# EAGLE schematic altair (EAGLE 9.4.1)

## Sheet 1 of 2
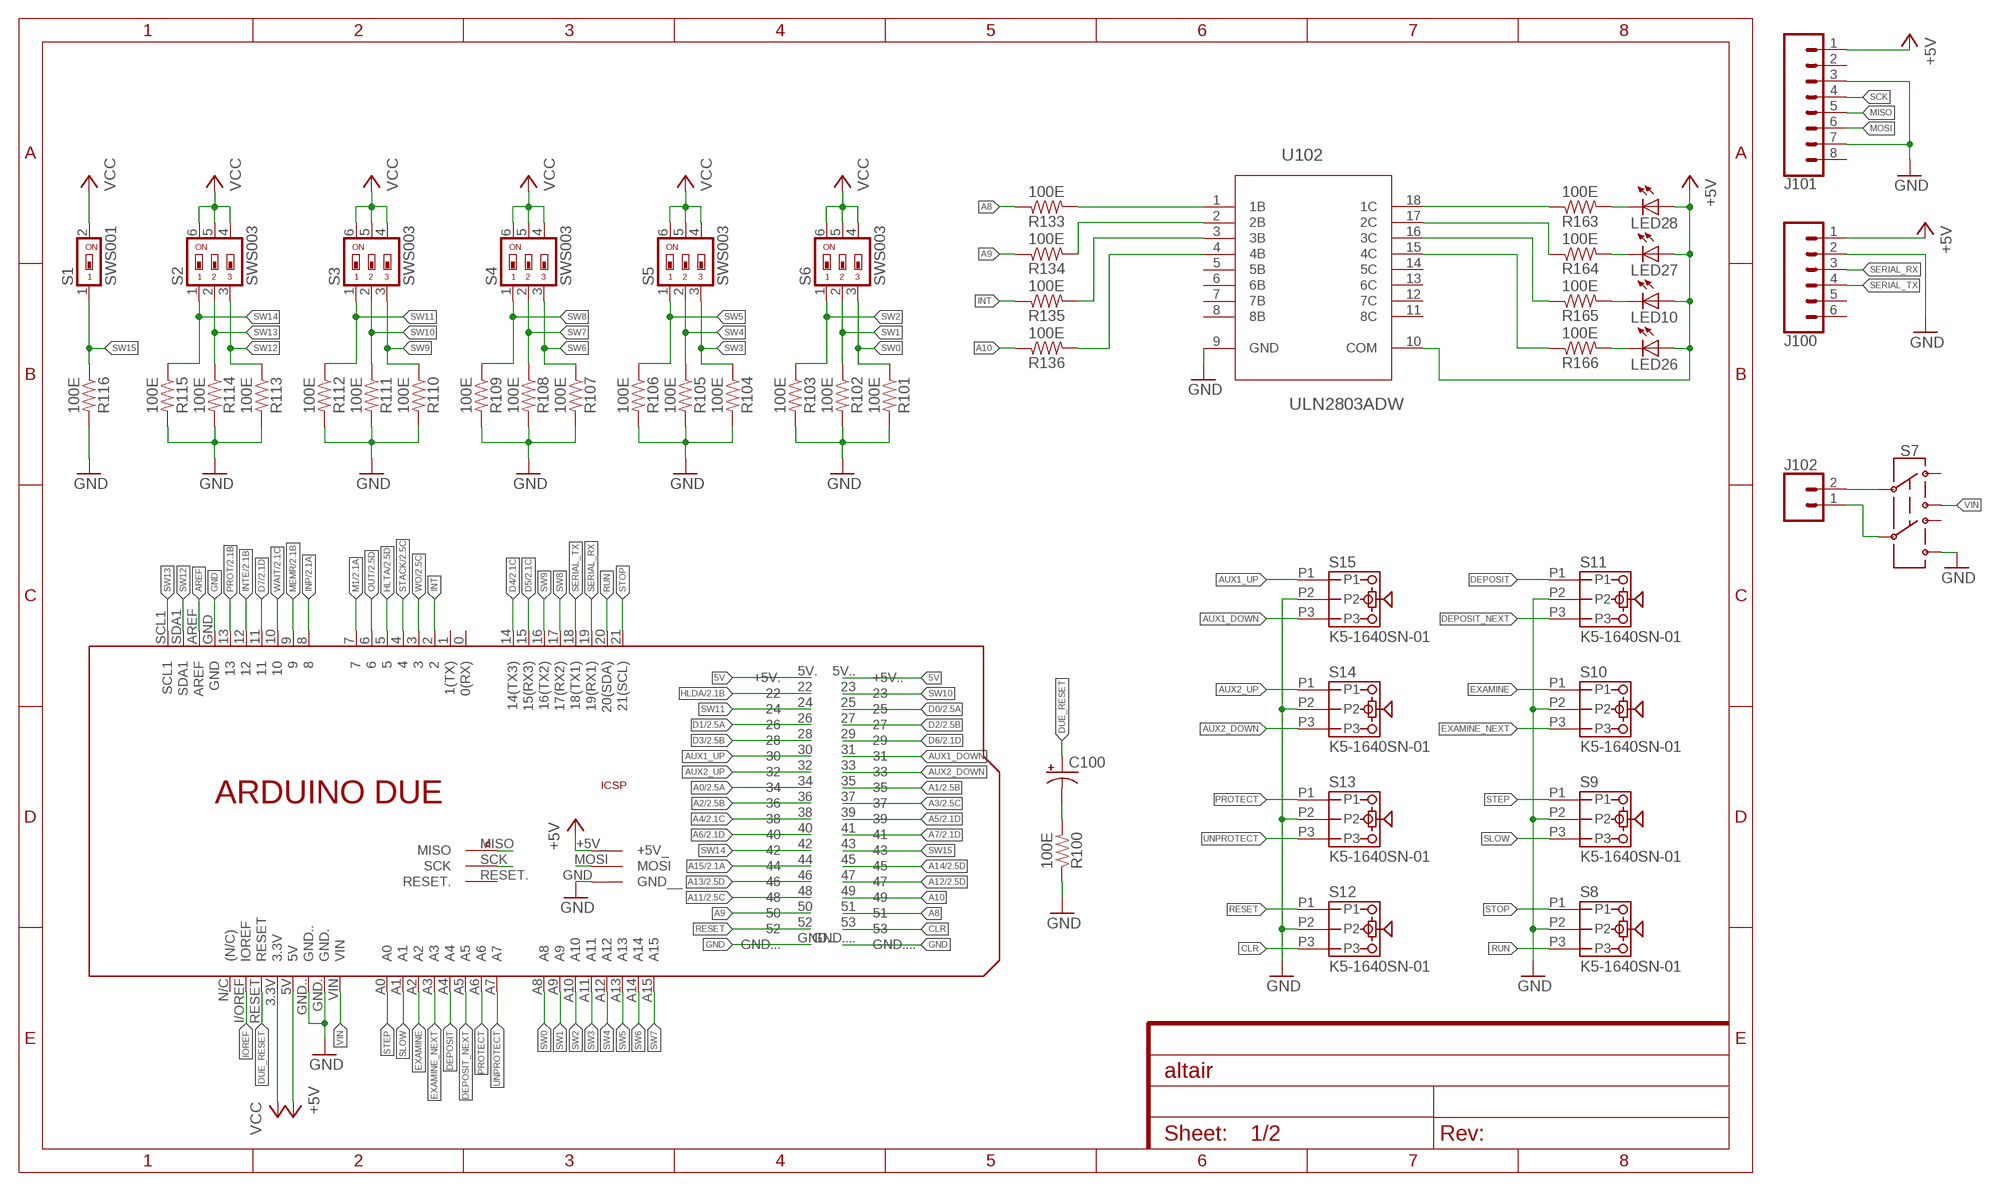
[diagram p0: schematic, sheet 1]

### Parts
C100  CPOL-USD  [PANASONIC_D]
J100  CONN_06LOCK  [1X06_LOCK]
J101  CONN_08LOCK  [1X08_LOCK]
J102  CONN_02POLAR_LOCK  [MOLEX-1X2_LOCK]
LED10  LEDCHIP-LED0805  [CHIP-LED0805]
LED26  LEDCHIP-LED0805  [CHIP-LED0805]
LED27  LEDCHIP-LED0805  [CHIP-LED0805]
LED28  LEDCHIP-LED0805  [CHIP-LED0805]
PCB1  ARDUINO_DUEARDUINO_DUE  [ARDUINO_MEGA2560]
R100  100E  RESISTOR0805  [0805]
R101  100E  RESISTOR0805  [0805]
R102  100E  RESISTOR0805  [0805]
R103  100E  RESISTOR0805  [0805]
R104  100E  RESISTOR0805  [0805]
R105  100E  RESISTOR0805  [0805]
R106  100E  RESISTOR0805  [0805]
R107  100E  RESISTOR0805  [0805]
R108  100E  RESISTOR0805  [0805]
R109  100E  RESISTOR0805  [0805]
R110  100E  RESISTOR0805  [0805]
R111  100E  RESISTOR0805  [0805]
R112  100E  RESISTOR0805  [0805]
R113  100E  RESISTOR0805  [0805]
R114  100E  RESISTOR0805  [0805]
R115  100E  RESISTOR0805  [0805]
R116  100E  RESISTOR0805  [0805]
R133  100E  RESISTOR0805  [0805]
R134  100E  RESISTOR0805  [0805]
R135  100E  RESISTOR0805  [0805]
R136  100E  RESISTOR0805  [0805]
R163  100E  RESISTOR0805  [0805]
R164  100E  RESISTOR0805  [0805]
R165  100E  RESISTOR0805  [0805]
R166  100E  RESISTOR0805  [0805]
S1  SWS001  [SMS-001]
S2  SWS003  [SMS-003]
S3  SWS003  [SMS-003]
S4  SWS003  [SMS-003]
S5  SWS003  [SMS-003]
S6  SWS003  [SMS-003]
S7  SWITCH-DPDT-SMD-AYZ0202  [SWITCH_DPDT_SMD_AYZ0202]
S8  K5-1640SN-01  [K5-1640SN-01]
S9  K5-1640SN-01  [K5-1640SN-01]
S10  K5-1640SN-01  [K5-1640SN-01]
S11  K5-1640SN-01  [K5-1640SN-01]
S12  K5-1640SN-01  [K5-1640SN-01]
S13  K5-1640SN-01  [K5-1640SN-01]
S14  K5-1640SN-01  [K5-1640SN-01]
S15  K5-1640SN-01  [K5-1640SN-01]
U102  ULN2803ADW  [SOIC127P1030X265-18N]

### Nets
5V: PCB1.5V.(+5V.) PCB1.5V..(+5V..)
+5V: J100.1 J101.1 LED10.A LED26.A LED27.A LED28.A PCB1.5V PCB1.+5V_ U102.10(COM) ; also sheet 2
A0: PCB1.34 ; also sheet 2
A1: PCB1.35 ; also sheet 2
A2: PCB1.36 ; also sheet 2
A3: PCB1.37 ; also sheet 2
A4: PCB1.38 ; also sheet 2
A5: PCB1.39 ; also sheet 2
A6: PCB1.40 ; also sheet 2
A7: PCB1.41 ; also sheet 2
A8: PCB1.51 R133.1
A9: PCB1.50 R134.1
A10: PCB1.49 R136.1
A11: PCB1.48 ; also sheet 2
A12: PCB1.47 ; also sheet 2
A13: PCB1.46 ; also sheet 2
A14: PCB1.45 ; also sheet 2
A15: PCB1.44 ; also sheet 2
AREF: PCB1.AREF
AUX1_DOWN: PCB1.31 S15.P3
AUX1_UP: PCB1.30 S15.P1
AUX2_DOWN: PCB1.33 S14.P3
AUX2_UP: PCB1.32 S14.P1
CLR: PCB1.53 S12.P3
D0: PCB1.25 ; also sheet 2
D1: PCB1.26 ; also sheet 2
D2: PCB1.27 ; also sheet 2
D3: PCB1.28 ; also sheet 2
D4: PCB1.14(14(TX3)) ; also sheet 2
D5: PCB1.15(15(RX3)) ; also sheet 2
D6: PCB1.29 ; also sheet 2
D7: PCB1.11 ; also sheet 2
DEPOSIT: PCB1.A4 S11.P1
DEPOSIT_NEXT: PCB1.A5 S11.P3
DUE_RESET: C100.+ PCB1.RESET
EXAMINE: PCB1.A2 S10.P1
EXAMINE_NEXT: PCB1.A3 S10.P3
GND: J100.2 J101.3 J101.7 PCB1.GND PCB1.GND. PCB1.GND.. PCB1.GND... PCB1.GND.... PCB1.GND__ R100.1 R101.2 R102.2 R103.2 R104.2 R105.2 R106.2 R107.2 R108.2 R109.2 R110.2 R111.2 R112.2 R113.2 R114.2 R115.2 R116.2 S7.6 S8.P2 S9.P2 S10.P2 S11.P2 S12.P2 S13.P2 S14.P2 S15.P2 U102.9(GND) ; also sheet 2
HLDA: PCB1.22 ; also sheet 2
HLTA: PCB1.5 ; also sheet 2
INP: PCB1.8 ; also sheet 2
INT: PCB1.2 R135.1
INTE: PCB1.12 ; also sheet 2
IOREF: PCB1.I/OREF(IOREF)
M1: PCB1.7 ; also sheet 2
MEMR: PCB1.9 ; also sheet 2
MISO: J101.5 PCB1.MISO
MOSI: J101.6 PCB1.MOSI
N$1: LED28.C R163.2
N$2: LED27.C R164.2
N$3: LED10.C R165.2
N$4: LED26.C R166.2
N$9: R163.1 U102.18(1C)
N$10: R164.1 U102.17(2C)
N$11: R165.1 U102.16(3C)
N$12: R166.1 U102.15(4C)
N$13: C100.- R100.2
N$19: R133.2 U102.1(1B)
N$20: R134.2 U102.2(2B)
N$21: R135.2 U102.3(3B)
N$22: R136.2 U102.4(4B)
N$97: J102.2 S7.2
N$98: J102.1 S7.5
OUT: PCB1.6 ; also sheet 2
PROT: PCB1.13 ; also sheet 2
PROTECT: PCB1.A6 S13.P1
RESET: PCB1.52 S12.P1
RUN: PCB1.20(20(SDA)) S8.P3
SCK: J101.4 PCB1.SCK
SERIAL_RX: J100.3 PCB1.19(19(RX1))
SERIAL_TX: J100.4 PCB1.18(18(TX1))
SLOW: PCB1.A1 S9.P3
STACK: PCB1.4 ; also sheet 2
STEP: PCB1.A0 S9.P1
STOP: PCB1.21(21(SCL)) S8.P1
SW0: PCB1.A8 R101.1 S6.3
SW1: PCB1.A9 R102.1 S6.2
SW2: PCB1.A10 R103.1 S6.1
SW3: PCB1.A11 R104.1 S5.3
SW4: PCB1.A12 R105.1 S5.2
SW5: PCB1.A13 R106.1 S5.1
SW6: PCB1.A14 R107.1 S4.3
SW7: PCB1.A15 R108.1 S4.2
SW8: PCB1.17(17(RX2)) R109.1 S4.1
SW9: PCB1.16(16(TX2)) R110.1 S3.3
SW10: PCB1.23 R111.1 S3.2
SW11: PCB1.24 R112.1 S3.1
SW12: PCB1.SDA1 R113.1 S2.3
SW13: PCB1.SCL1 R114.1 S2.2
SW14: PCB1.42 R115.1 S2.1
SW15: PCB1.43 R116.1 S1.1
UNPROTECT: PCB1.A7 S13.P3
VCC: PCB1.3.3V S1.2 S2.4 S2.5 S2.6 S3.4 S3.5 S3.6 S4.4 S4.5 S4.6 S5.4 S5.5 S5.6 S6.4 S6.5 S6.6
VIN: PCB1.VIN S7.3
WAIT: PCB1.10 ; also sheet 2
WO: PCB1.3 ; also sheet 2
Unconnected: J100.5 J100.6 J101.2 J101.8 PCB1.0(0(RX)) PCB1.1(1(TX)) PCB1.N/C((N/C)) PCB1.RESET. S7.1 S7.4 U102.5(5B) U102.6(6B) U102.7(7B) U102.8(8B) U102.11(8C) U102.12(7C) U102.13(6C) U102.14(5C)

## Sheet 2 of 2
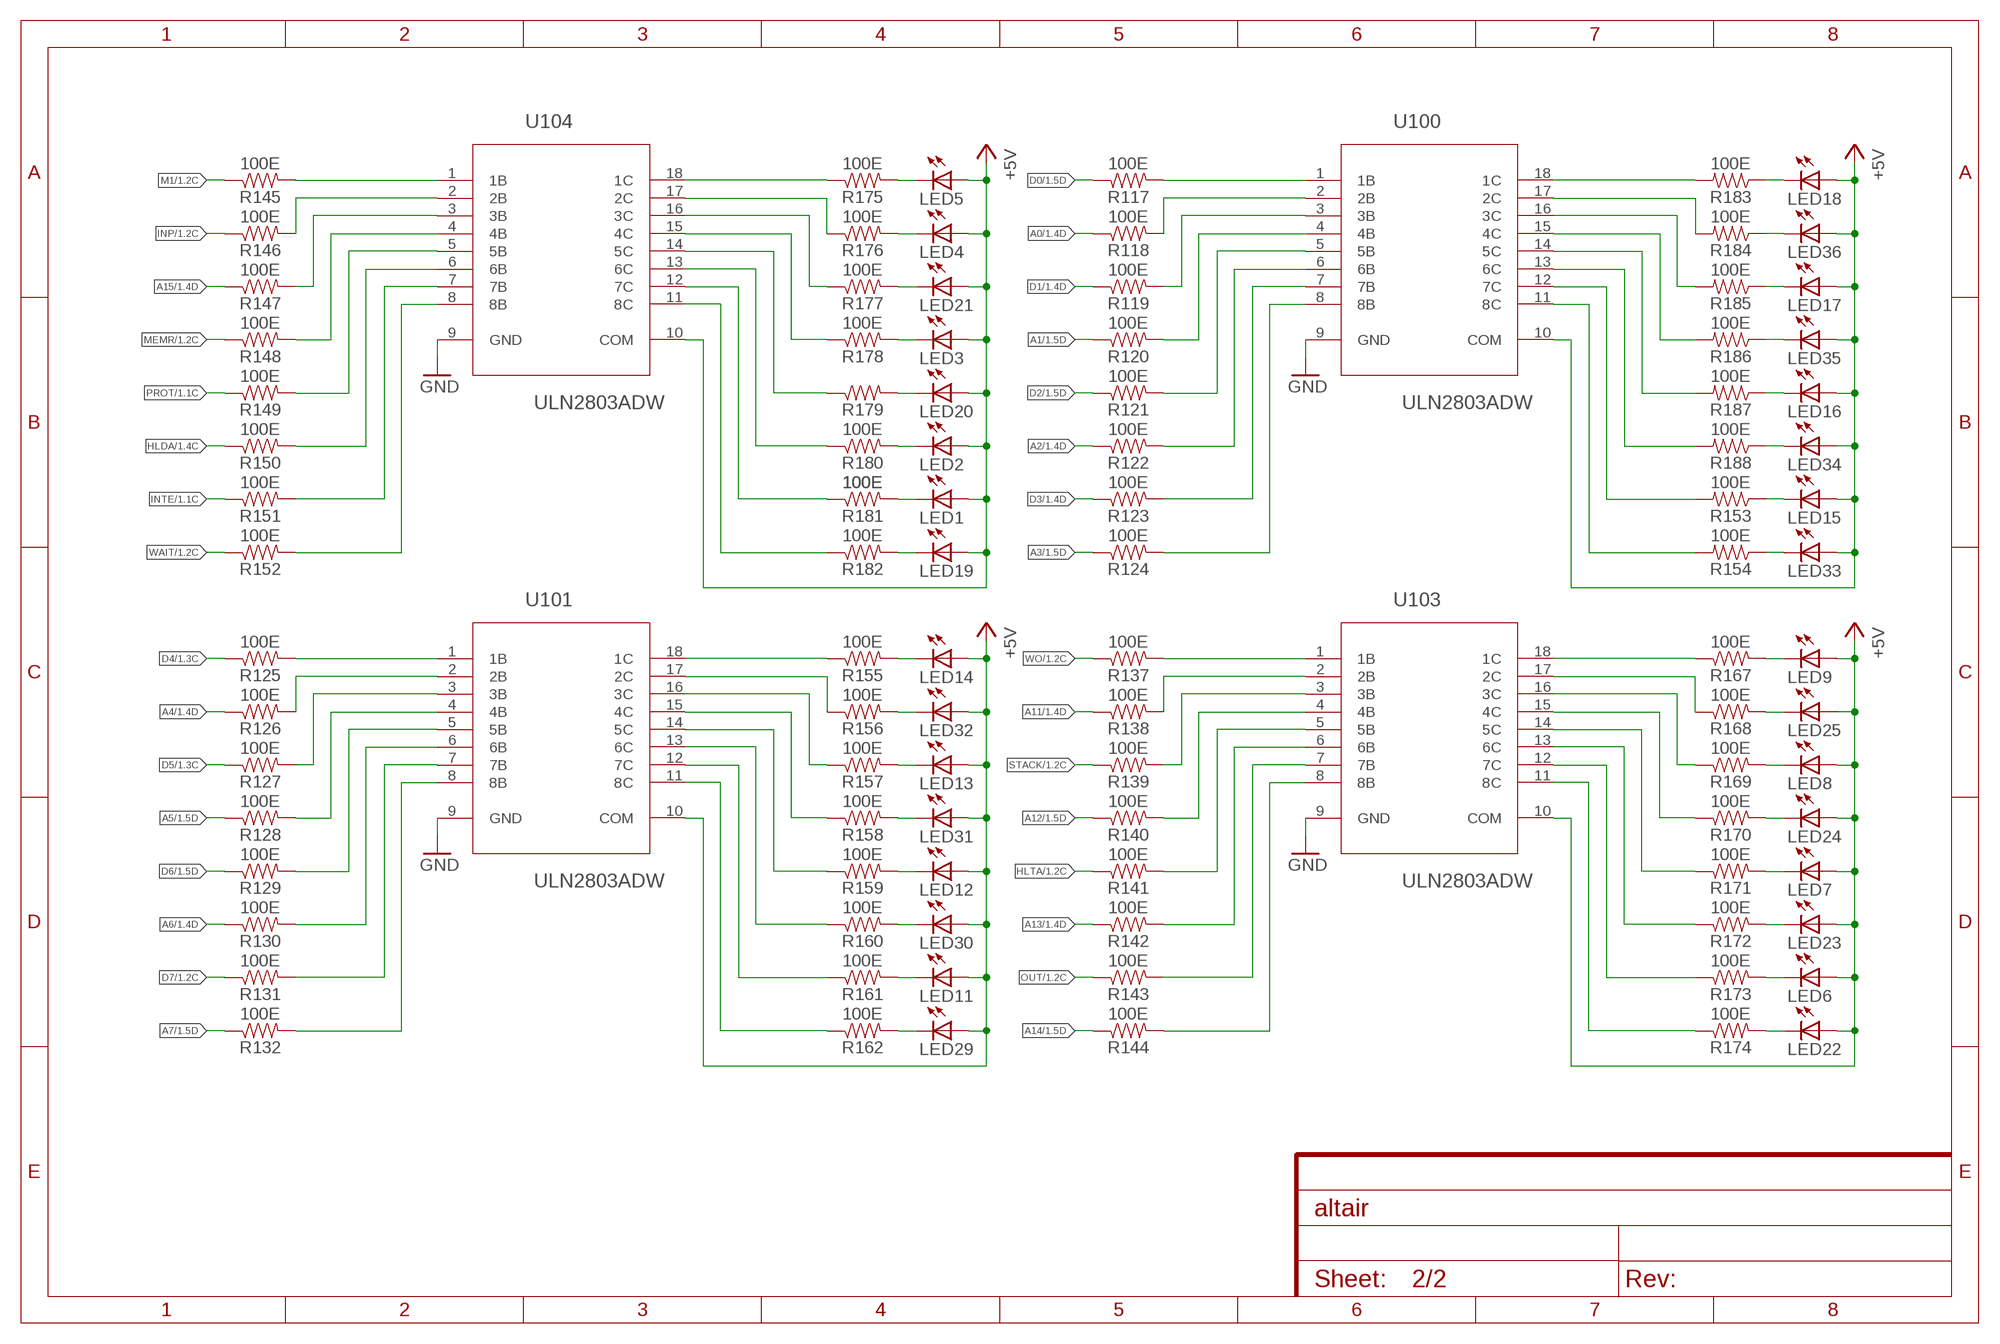
[diagram p1: schematic, sheet 2]

### Parts
LED1  LEDCHIP-LED0805  [CHIP-LED0805]
LED2  LEDCHIP-LED0805  [CHIP-LED0805]
LED3  LEDCHIP-LED0805  [CHIP-LED0805]
LED4  LEDCHIP-LED0805  [CHIP-LED0805]
LED5  LEDCHIP-LED0805  [CHIP-LED0805]
LED6  LEDCHIP-LED0805  [CHIP-LED0805]
LED7  LEDCHIP-LED0805  [CHIP-LED0805]
LED8  LEDCHIP-LED0805  [CHIP-LED0805]
LED9  LEDCHIP-LED0805  [CHIP-LED0805]
LED11  LEDCHIP-LED0805  [CHIP-LED0805]
LED12  LEDCHIP-LED0805  [CHIP-LED0805]
LED13  LEDCHIP-LED0805  [CHIP-LED0805]
LED14  LEDCHIP-LED0805  [CHIP-LED0805]
LED15  LEDCHIP-LED0805  [CHIP-LED0805]
LED16  LEDCHIP-LED0805  [CHIP-LED0805]
LED17  LEDCHIP-LED0805  [CHIP-LED0805]
LED18  LEDCHIP-LED0805  [CHIP-LED0805]
LED19  LEDCHIP-LED0805  [CHIP-LED0805]
LED20  LEDCHIP-LED0805  [CHIP-LED0805]
LED21  LEDCHIP-LED0805  [CHIP-LED0805]
LED22  LEDCHIP-LED0805  [CHIP-LED0805]
LED23  LEDCHIP-LED0805  [CHIP-LED0805]
LED24  LEDCHIP-LED0805  [CHIP-LED0805]
LED25  LEDCHIP-LED0805  [CHIP-LED0805]
LED29  LEDCHIP-LED0805  [CHIP-LED0805]
LED30  LEDCHIP-LED0805  [CHIP-LED0805]
LED31  LEDCHIP-LED0805  [CHIP-LED0805]
LED32  LEDCHIP-LED0805  [CHIP-LED0805]
LED33  LEDCHIP-LED0805  [CHIP-LED0805]
LED34  LEDCHIP-LED0805  [CHIP-LED0805]
LED35  LEDCHIP-LED0805  [CHIP-LED0805]
LED36  LEDCHIP-LED0805  [CHIP-LED0805]
R117  100E  RESISTOR0805  [0805]
R118  100E  RESISTOR0805  [0805]
R119  100E  RESISTOR0805  [0805]
R120  100E  RESISTOR0805  [0805]
R121  100E  RESISTOR0805  [0805]
R122  100E  RESISTOR0805  [0805]
R123  100E  RESISTOR0805  [0805]
R124  100E  RESISTOR0805  [0805]
R125  100E  RESISTOR0805  [0805]
R126  100E  RESISTOR0805  [0805]
R127  100E  RESISTOR0805  [0805]
R128  100E  RESISTOR0805  [0805]
R129  100E  RESISTOR0805  [0805]
R130  100E  RESISTOR0805  [0805]
R131  100E  RESISTOR0805  [0805]
R132  100E  RESISTOR0805  [0805]
R137  100E  RESISTOR0805  [0805]
R138  100E  RESISTOR0805  [0805]
R139  100E  RESISTOR0805  [0805]
R140  100E  RESISTOR0805  [0805]
R141  100E  RESISTOR0805  [0805]
R142  100E  RESISTOR0805  [0805]
R143  100E  RESISTOR0805  [0805]
R144  100E  RESISTOR0805  [0805]
R145  100E  RESISTOR0805  [0805]
R146  100E  RESISTOR0805  [0805]
R147  100E  RESISTOR0805  [0805]
R148  100E  RESISTOR0805  [0805]
R149  100E  RESISTOR0805  [0805]
R150  100E  RESISTOR0805  [0805]
R151  100E  RESISTOR0805  [0805]
R152  100E  RESISTOR0805  [0805]
R153  100E  RESISTOR0805  [0805]
R154  100E  RESISTOR0805  [0805]
R155  100E  RESISTOR0805  [0805]
R156  100E  RESISTOR0805  [0805]
R157  100E  RESISTOR0805  [0805]
R158  100E  RESISTOR0805  [0805]
R159  100E  RESISTOR0805  [0805]
R160  100E  RESISTOR0805  [0805]
R161  100E  RESISTOR0805  [0805]
R162  100E  RESISTOR0805  [0805]
R167  100E  RESISTOR0805  [0805]
R168  100E  RESISTOR0805  [0805]
R169  100E  RESISTOR0805  [0805]
R170  100E  RESISTOR0805  [0805]
R171  100E  RESISTOR0805  [0805]
R172  100E  RESISTOR0805  [0805]
R173  100E  RESISTOR0805  [0805]
R174  100E  RESISTOR0805  [0805]
R175  100E  RESISTOR0805  [0805]
R176  100E  RESISTOR0805  [0805]
R177  100E  RESISTOR0805  [0805]
R178  100E  RESISTOR0805  [0805]
R179  100E  RESISTOR0805  [0805]
R180  100E  RESISTOR0805  [0805]
R181  100E  RESISTOR0805  [0805]
R182  100E  RESISTOR0805  [0805]
R183  100E  RESISTOR0805  [0805]
R184  100E  RESISTOR0805  [0805]
R185  100E  RESISTOR0805  [0805]
R186  100E  RESISTOR0805  [0805]
R187  100E  RESISTOR0805  [0805]
R188  100E  RESISTOR0805  [0805]
U100  ULN2803ADW  [SOIC127P1030X265-18N]
U101  ULN2803ADW  [SOIC127P1030X265-18N]
U103  ULN2803ADW  [SOIC127P1030X265-18N]
U104  ULN2803ADW  [SOIC127P1030X265-18N]

### Nets
+5V: LED1.A LED2.A LED3.A LED4.A LED5.A LED6.A LED7.A LED8.A LED9.A LED11.A LED12.A LED13.A LED14.A LED15.A LED16.A LED17.A LED18.A LED19.A LED20.A LED21.A LED22.A LED23.A LED24.A LED25.A LED29.A LED30.A LED31.A LED32.A LED33.A LED34.A LED35.A LED36.A U100.10(COM) U101.10(COM) U103.10(COM) U104.10(COM) ; also sheet 1
A0: R118.1 ; also sheet 1
A1: R120.1 ; also sheet 1
A2: R122.1 ; also sheet 1
A3: R124.1 ; also sheet 1
A4: R126.1 ; also sheet 1
A5: R128.1 ; also sheet 1
A6: R130.1 ; also sheet 1
A7: R132.1 ; also sheet 1
A11: R138.1 ; also sheet 1
A12: R140.1 ; also sheet 1
A13: R142.1 ; also sheet 1
A14: R144.1 ; also sheet 1
A15: R147.1 ; also sheet 1
D0: R117.1 ; also sheet 1
D1: R119.1 ; also sheet 1
D2: R121.1 ; also sheet 1
D3: R123.1 ; also sheet 1
D4: R125.1 ; also sheet 1
D5: R127.1 ; also sheet 1
D6: R129.1 ; also sheet 1
D7: R131.1 ; also sheet 1
GND: U100.9(GND) U101.9(GND) U103.9(GND) U104.9(GND) ; also sheet 1
HLDA: R150.1 ; also sheet 1
HLTA: R141.1 ; also sheet 1
INP: R146.1 ; also sheet 1
INTE: R151.1 ; also sheet 1
M1: R145.1 ; also sheet 1
MEMR: R148.1 ; also sheet 1
N$5: R183.2 U100.18(1C)
N$6: R184.2 U100.17(2C)
N$7: R185.2 U100.16(3C)
N$8: R186.2 U100.15(4C)
N$14: R187.2 U100.14(5C)
N$15: R188.2 U100.13(6C)
N$16: R153.2 U100.12(7C)
N$17: LED5.C R175.2
N$18: LED4.C R176.2
N$23: R154.2 U100.11(8C)
N$24: LED18.C R183.1
N$25: LED36.C R184.1
N$26: LED17.C R185.1
N$27: LED21.C R177.2
N$28: LED3.C R178.2
N$29: LED20.C R179.2
N$30: LED2.C R180.2
N$31: LED1.C R181.2
N$32: LED19.C R182.2
N$33: R181.1 U104.12(7C)
N$34: R176.1 U104.17(2C)
N$35: R177.1 U104.16(3C)
N$36: R178.1 U104.15(4C)
N$37: R179.1 U104.14(5C)
N$38: R180.1 U104.13(6C)
N$39: R182.1 U104.11(8C)
N$40: R175.1 U104.18(1C)
N$41: R145.2 U104.1(1B)
N$42: R146.2 U104.2(2B)
N$43: R147.2 U104.3(3B)
N$44: R148.2 U104.4(4B)
N$45: R149.2 U104.5(5B)
N$46: R150.2 U104.6(6B)
N$47: R151.2 U104.7(7B)
N$48: R152.2 U104.8(8B)
N$49: LED35.C R186.1
N$50: LED16.C R187.1
N$51: LED34.C R188.1
N$52: LED15.C R153.1
N$53: LED33.C R154.1
N$54: LED9.C R167.2
N$55: R173.1 U103.12(7C)
N$56: R174.1 U103.11(8C)
N$57: LED25.C R168.2
N$58: LED8.C R169.2
N$59: LED24.C R170.2
N$60: LED7.C R171.2
N$61: LED23.C R172.2
N$62: LED6.C R173.2
N$63: LED22.C R174.2
N$64: R167.1 U103.18(1C)
N$65: R117.2 U100.1(1B)
N$66: R118.2 U100.2(2B)
N$67: R119.2 U100.3(3B)
N$68: R120.2 U100.4(4B)
N$69: R121.2 U100.5(5B)
N$70: R122.2 U100.6(6B)
N$71: R123.2 U100.7(7B)
N$72: R124.2 U100.8(8B)
N$73: R161.1 U101.12(7C)
N$74: R162.1 U101.11(8C)
N$75: LED14.C R155.2
N$76: LED32.C R156.2
N$77: LED13.C R157.2
N$78: LED31.C R158.2
N$79: LED12.C R159.2
N$80: LED30.C R160.2
N$81: LED11.C R161.2
N$82: R156.1 U101.17(2C)
N$83: R157.1 U101.16(3C)
N$84: R158.1 U101.15(4C)
N$85: R159.1 U101.14(5C)
N$86: R160.1 U101.13(6C)
N$87: LED29.C R162.2
N$88: R155.1 U101.18(1C)
N$89: R125.2 U101.1(1B)
N$90: R126.2 U101.2(2B)
N$91: R127.2 U101.3(3B)
N$92: R128.2 U101.4(4B)
N$93: R129.2 U101.5(5B)
N$94: R130.2 U101.6(6B)
N$95: R131.2 U101.7(7B)
N$96: R132.2 U101.8(8B)
N$106: R168.1 U103.17(2C)
N$107: R169.1 U103.16(3C)
N$108: R170.1 U103.15(4C)
N$109: R171.1 U103.14(5C)
N$110: R172.1 U103.13(6C)
N$113: R137.2 U103.1(1B)
N$114: R138.2 U103.2(2B)
N$115: R139.2 U103.3(3B)
N$116: R140.2 U103.4(4B)
N$117: R141.2 U103.5(5B)
N$118: R142.2 U103.6(6B)
N$119: R143.2 U103.7(7B)
N$120: R144.2 U103.8(8B)
OUT: R143.1 ; also sheet 1
PROT: R149.1 ; also sheet 1
STACK: R139.1 ; also sheet 1
WAIT: R152.1 ; also sheet 1
WO: R137.1 ; also sheet 1

## Library data of the parts
C100 = adafruit:CPOL-US: POLARIZED CAPACITOR, American symbol
J100 = SparkFun-Connectors:CONN_06: Multi connection point. Often used as Generic Header-pin footprint for 0.1 inch spaced/style header connections On any of the 0.1 inch spaced packages, you can populate with these: Break Away Headers - Straight <https://www.sparkfun.com/products/116> (PRT-00116) Break Away Male Headers - Right Angle <https://www.sparkfun.com/products/553> (PRT-00553) Female Headers <https://www.sparkfun.com/products/115> (PRT-00115) Break Away Headers - Machine Pin <https://www.sparkfun.com/products/117> (PRT-00117) Break Away Female Headers - Swiss Machine Pin <https://www.sparkfun.com/products/743> (PRT-00743) Arduino Stackable Header - 6 Pin <https://www.sparkfun.com/products/9280> (PRT-09280) For SCREWTERMINALS and SPRING TERMINALS visit here: Screw Terimnals on SparkFun.com <https://www.sparkfun.com/search/results?term=Screw+Terminals> (5mm/3.5mm/2.54mm spacing) This device is also useful as a general connection point to wire up your design to another part of your project. Our various solder wires solder well into these plated through hole pads. Hook-Up Wire - Assortment (Stranded, 22 AWG) <https://www.sparkfun.com/products/11375> (PRT-11375) Hook-Up Wire - Assortment (Solid Core, 22 AWG) <https://www.sparkfun.com/products/11367> (PRT-11367) View the entire wire category on our website here <https://www.sparkfun.com/categories/141>
J101 = SparkFun-Connectors:CONN_08: Multi connection point. Often used as Generic Header-pin footprint for 0.1 inch spaced/style header connections On any of the 0.1 inch spaced packages, you can populate with these: Break Away Headers - Straight <https://www.sparkfun.com/products/116> (PRT-00116) Break Away Male Headers - Right Angle <https://www.sparkfun.com/products/553> (PRT-00553) Female Headers <https://www.sparkfun.com/products/115> (PRT-00115) Break Away Headers - Machine Pin <https://www.sparkfun.com/products/117> (PRT-00117) Break Away Female Headers - Swiss Machine Pin <https://www.sparkfun.com/products/743> (PRT-00743) Arduino Stackable Header - 8 Pin <https://www.sparkfun.com/products/9279> (PRT-09279) For SCREWTERMINALS and SPRING TERMINALS visit here: Screw Terimnals on SparkFun.com <https://www.sparkfun.com/search/results?term=Screw+Terminals> (5mm/3.5mm/2.54mm spacing) This device is also useful as a general connection point to wire up your design to another part of your project. Our various solder wires solder well into these plated through hole pads. Hook-Up Wire - Assortment (Stranded, 22 AWG) <https://www.sparkfun.com/products/11375> (PRT-11375) Hook-Up Wire - Assortment (Solid Core, 22 AWG) <https://www.sparkfun.com/products/11367> (PRT-11367) View the entire wire category on our website here <https://www.sparkfun.com/categories/141> Special notes: Molex polarized connector foot print use with SKU : PRT-08231 with associated crimp pins and housings. 1MM SMD Version SKU: PRT-10208 NOTES ON THE VARIANTS LOCK and LOCK_LONGPADS... This footprint was designed to help hold the alignment of a through-hole component (i.e. 6-pin header) while soldering it into place. You may notice that each hole has been shifted either up or down by 0.005 of an inch from it's more standard position (which is a perfectly straight line). This slight alteration caused the pins (the squares in the middle) to touch the edges of the holes. Because they are alternating, it causes a "brace" to hold the component in place. 0.005 has proven to be the perfect amount of "off-center" position when using our standard breakaway headers. Although looks a little odd when you look at the bare footprint, once you have a header in there, the alteration is very hard to notice. Also,if you push a header all the way into place, it is covered up entirely on the bottom side.
J102 = SparkFun-Connectors:CONN_02: Multi connection point. Often used as Generic Header-pin footprint for 0.1 inch spaced/style header connections On any of the 0.1 inch spaced packages, you can populate with these: Break Away Headers - Straight <https://www.sparkfun.com/products/116> (PRT-00116) Break Away Male Headers - Right Angle <https://www.sparkfun.com/products/553> (PRT-00553) Female Headers <https://www.sparkfun.com/products/115> (PRT-00115) Break Away Headers - Machine Pin <https://www.sparkfun.com/products/117> (PRT-00117) Break Away Female Headers - Swiss Machine Pin <https://www.sparkfun.com/products/743> (PRT-00743) For SCREWTERMINALS and SPRING TERMINALS visit here: Screw Terimnals on SparkFun.com <https://www.sparkfun.com/search/results?term=Screw+Terminals> (5mm/3.5mm/2.54mm spacing) This device is also useful as a general connection point to wire up your design to another part of your project. Our various solder wires solder well into these plated through hole pads. Hook-Up Wire - Assortment (Stranded, 22 AWG) <https://www.sparkfun.com/products/11375> (PRT-11375) Hook-Up Wire - Assortment (Solid Core, 22 AWG) <https://www.sparkfun.com/products/11367> (PRT-11367) View the entire wire category on our website here <https://www.sparkfun.com/categories/141> Special notes: Molex polarized connector foot print use with: PRT-08233 with associated crimp pins and housings. 2.54_SCREWTERM for use with PRT-10571. 3.5mm Screw Terminal footprints for PRT-08084 5mm Screw Terminal footprints for use with PRT-08432; SF_ID: PRT-09918
LED1-LED36 = adafruit:LED: LED OSRAM: - CHIPLED LG R971, LG N971, LY N971, LG Q971, LY Q971, LO R971, LY R971 LH N974, LH R974 LS Q976, LO Q976, LY Q976 LO Q996 - Hyper CHIPLED LW Q18S LB Q993, LB Q99A, LB R99A - SideLED LS A670, LO A670, LY A670, LG A670, LP A670 LB A673, LV A673, LT A673, LW A673 LH A674 LY A675 LS A676, LA A676, LO A676, LY A676, LW A676 LS A679, LY A679, LG A679 - Hyper Micro SIDELED® LS Y876, LA Y876, LO Y876, LY Y876 LT Y87S - SmartLED LW L88C, LW L88S LB L89C, LB L89S, LG L890 LS L89K, LO L89K, LY L89K LS L896, LA L896, LO L896, LY L896 - TOPLED LS T670, LO T670, LY T670, LG T670, LP T670 LSG T670, LSP T670, LSY T670, LOP T670, LYG T670 LG T671, LOG T671, LSG T671 LB T673, LV T673, LT T673, LW T673 LH T674 LS T676, LA T676, LO T676, LY T676, LB T676, LH T676, LSB T676, LW T676 LB T67C, LV T67C, LT T67C, LS T67K, LO T67K, LY T67K, LW E67C LS E67B, LA E67B, LO E67B, LY E67B, LB E67C, LV E67C, LT E67C LW T67C LS T679, LY T679, LG T679 LS T770, LO T770, LY T770, LG T770, LP T770 LB T773, LV T773, LT T773, LW T773 LH T774 LS E675, LA E675, LY E675, LS T675 LS T776, LA T776, LO T776, LY T776, LB T776 LHGB T686 LT T68C, LB T68C - Hyper Mini TOPLED® LB M676 - Mini TOPLED Santana® LG M470 LS M47K, LO M47K, LY M47K Source: http://www.osram.convergy.de/
PCB1 = Mega:ARDUINO_DUE: Device for representing an Arduino Mega 2560 board with a footprint in an EAGLE design. Created by Dave Young for Element14. More EAGLE documentation at: http://www.element14.com/community/community/knode/cadsoft_eagle
R100-R188 = SparkFun-Resistors:RESISTOR: Generic Resistor Package
S1 = smd-special:SWS001: SMD Dip Switch 1 pol.
S2-S6 = smd-special:SWS003: SMD Dip Switch 3 pol.
S7 = SparkFun-Switches:SWITCH-DPDT: Double-Pole, Double-Throw (DPDT) Switch Double-pole, double-throw switches. Variant Overview PTH-GPI-152-3013 Used on SparkFun Geiger Counter <https://www.sparkfun.com/products/11345> SMD-AY0202 Surface Mount DPDT Switch <https://www.sparkfun.com/products/597> (COM-00597) Used on e.g. LilyPad Arduino USB - ATmega32U4 Board <https://www.sparkfun.com/products/12049>; PROD_ID: SWCH-08179; SF_SKU: COM-00597
S8-S15 = K5-1640SN-01:K5-1640SN-01: K5-1640SN-01
U100-U104 = Texas Instruments_By_element14_Batch_1:ULN2803ADW: Darlington transistor array; MPN: ULN2803ADW; OC_FARNELL: 1652419; OC_NEWARK: 69K0711; PACKAGE: SOIC-18; SUPPLIER: TEXAS INSTRUMENTS